# EAGLE design monBoard_1_backup (EAGLE 5.12)

## Sheet 1 of 3
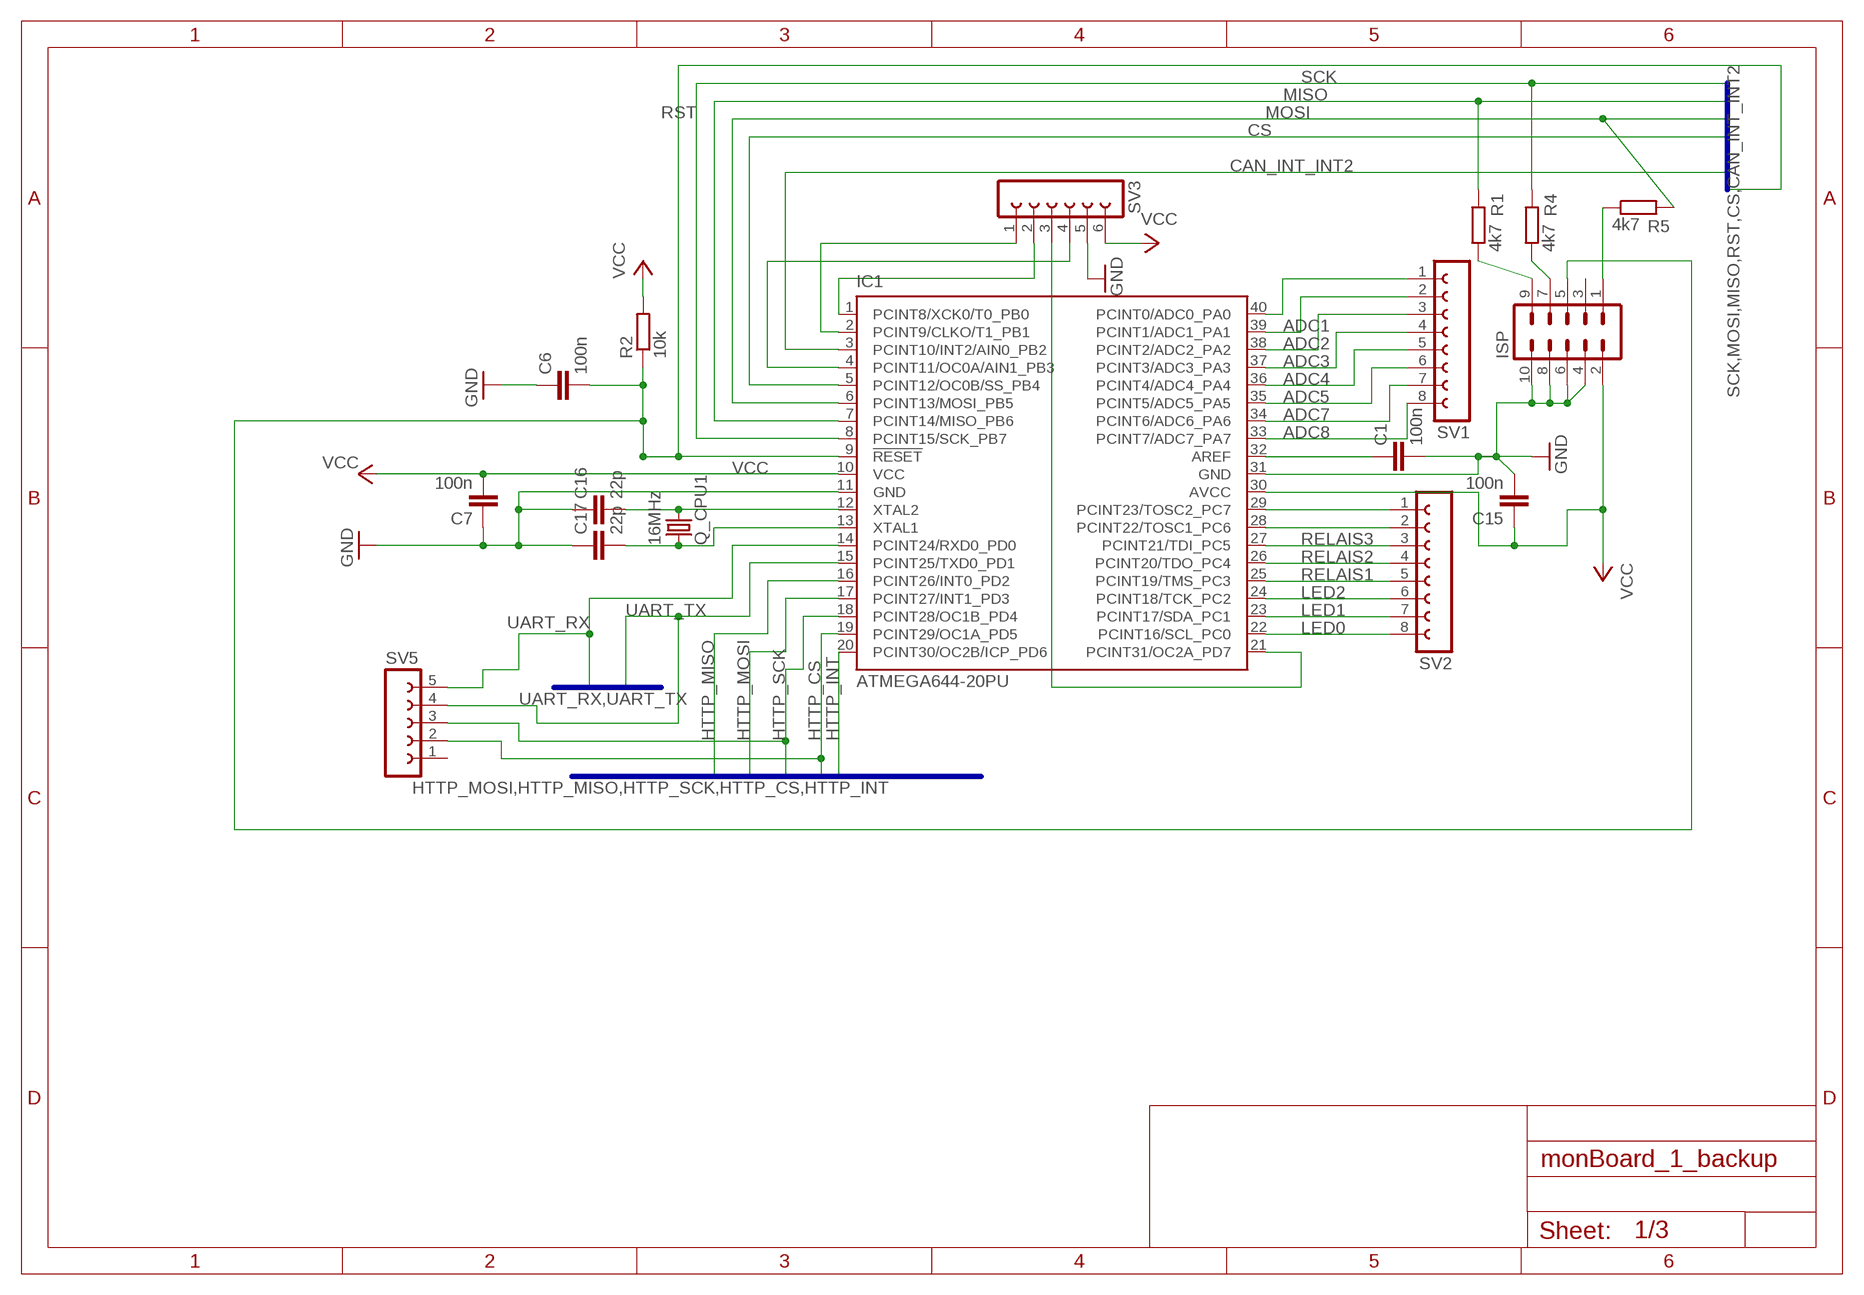
[diagram p0: schematic, sheet 1]

### Parts
C1  100n  C-EUC0603  [C0603]
C6  100n  C-EUC0603  [C0603]
C7  100n  C-EUC0603  [C0603]
C15  100n  C-EUC0603  [C0603]
C16  22p  C-EUC0603  [C0603]
C17  22p  C-EUC0603  [C0603]
IC1  ATMEGA644-20PU  [DIL40]
ISP  MA05-2  [MA05-2]
Q_CPU1  16MHz  CRYSTALHC49U-V  [HC49U-V]
R1  4k7  R-EU_R0805  [R0805]
R2  10k  R-EU_R0805  [R0805]
R4  4k7  R-EU_R0805  [R0805]
R5  4k7  R-EU_R0805  [R0805]
SV1  FE08-1  [FE08]
SV2  FE08-1  [FE08]
SV3  FE06-1  [FE06]
SV5  FE05-1  [FE05-1]

### Nets
ADC1: IC1.39(PCINT1/ADC1_PA1) SV1.2
ADC2: IC1.38(PCINT2/ADC2_PA2) SV1.3
ADC3: IC1.37(PCINT3/ADC3_PA3) SV1.4
ADC4: IC1.36(PCINT4/ADC4_PA4) SV1.5
ADC5: IC1.35(PCINT5/ADC5_PA5) SV1.6
ADC7: IC1.34(PCINT6/ADC6_PA6) SV1.7
ADC8: IC1.33(PCINT7/ADC7_PA7) SV1.8
CAN_INT_INT2: IC1.3(PCINT10/INT2/AIN0_PB2) ; also sheet 3
CS: IC1.5(PCINT12/OC0B/SS_PB4) ; also sheet 3
GND: C1.2 C6.1 C7.1 C15.2 C16.1 C17.1 IC1.11(GND) IC1.31(GND) ISP.4 ISP.6 ISP.8 ISP.10 SV3.5 ; also sheet 2,3
HTTP_CS: IC1.19(PCINT29/OC1A_PD5) SV5.2 ; also sheet 2
HTTP_INT: IC1.20(PCINT30/OC2B/ICP_PD6) ; also sheet 2
HTTP_MISO: IC1.16(PCINT26/INT0_PD2) ; also sheet 2
HTTP_MOSI: IC1.17(PCINT27/INT1_PD3) ; also sheet 2
HTTP_SCK: IC1.18(PCINT28/OC1B_PD4) SV5.3 ; also sheet 2
LED0: IC1.22(PCINT16/SCL_PC0) SV2.8
LED1: IC1.23(PCINT17/SDA_PC1) SV2.7
LED2: IC1.24(PCINT18/TCK_PC2) SV2.6
MISO: IC1.7(PCINT14/MISO_PB6) R1.2 ; also sheet 3
MOSI: IC1.6(PCINT13/MOSI_PB5) R5.2 ; also sheet 3
N$6: C16.2 IC1.12(XTAL2) Q_CPU1.1
N$7: C17.2 IC1.13(XTAL1) Q_CPU1.2
N$9: IC1.4(PCINT11/OC0A/AIN1_PB3) SV3.4
N$10: IC1.40(PCINT0/ADC0_PA0) SV1.1
N$14: IC1.29(PCINT23/TOSC2_PC7) SV2.1
N$19: C1.1 IC1.32(AREF)
N$20: ISP.9 R1.1
N$25: ISP.1 R5.1
N$29: ISP.7 R4.1
N$34: IC1.28(PCINT22/TOSC1_PC6) SV2.2
N$40: IC1.1(PCINT8/XCK0/T0_PB0) SV3.2
N$64: IC1.2(PCINT9/CLKO/T1_PB1) SV3.1
N$65: IC1.21(PCINT31/OC2A_PD7) SV3.3
RELAIS1: IC1.25(PCINT19/TMS_PC3) SV2.5
RELAIS2: IC1.26(PCINT20/TDO_PC4) SV2.4
RELAIS3: IC1.27(PCINT21/TDI_PC5) SV2.3
RST: C6.2 IC1.9(!RESET) ISP.5 R2.1 ; also sheet 3
SCK: IC1.8(PCINT15/SCK_PB7) R4.2 ; also sheet 3
UART_RX: IC1.14(PCINT24/RXD0_PD0) SV5.5 ; also sheet 3
UART_TX: IC1.15(PCINT25/TXD0_PD1) SV5.4 ; also sheet 3
VCC: C7.2 C15.1 IC1.10(VCC) IC1.30(AVCC) ISP.2 R2.2 SV3.6 ; also sheet 3
Unconnected: ISP.3 SV5.1

### Buses
SCK,MOSI,MISO,RST,CS,CAN_INT_INT2
UART_RX,UART_TX
HTTP_MOSI,HTTP_MISO,HTTP_SCK,HTTP_CS,HTTP_INT

## Sheet 2 of 3
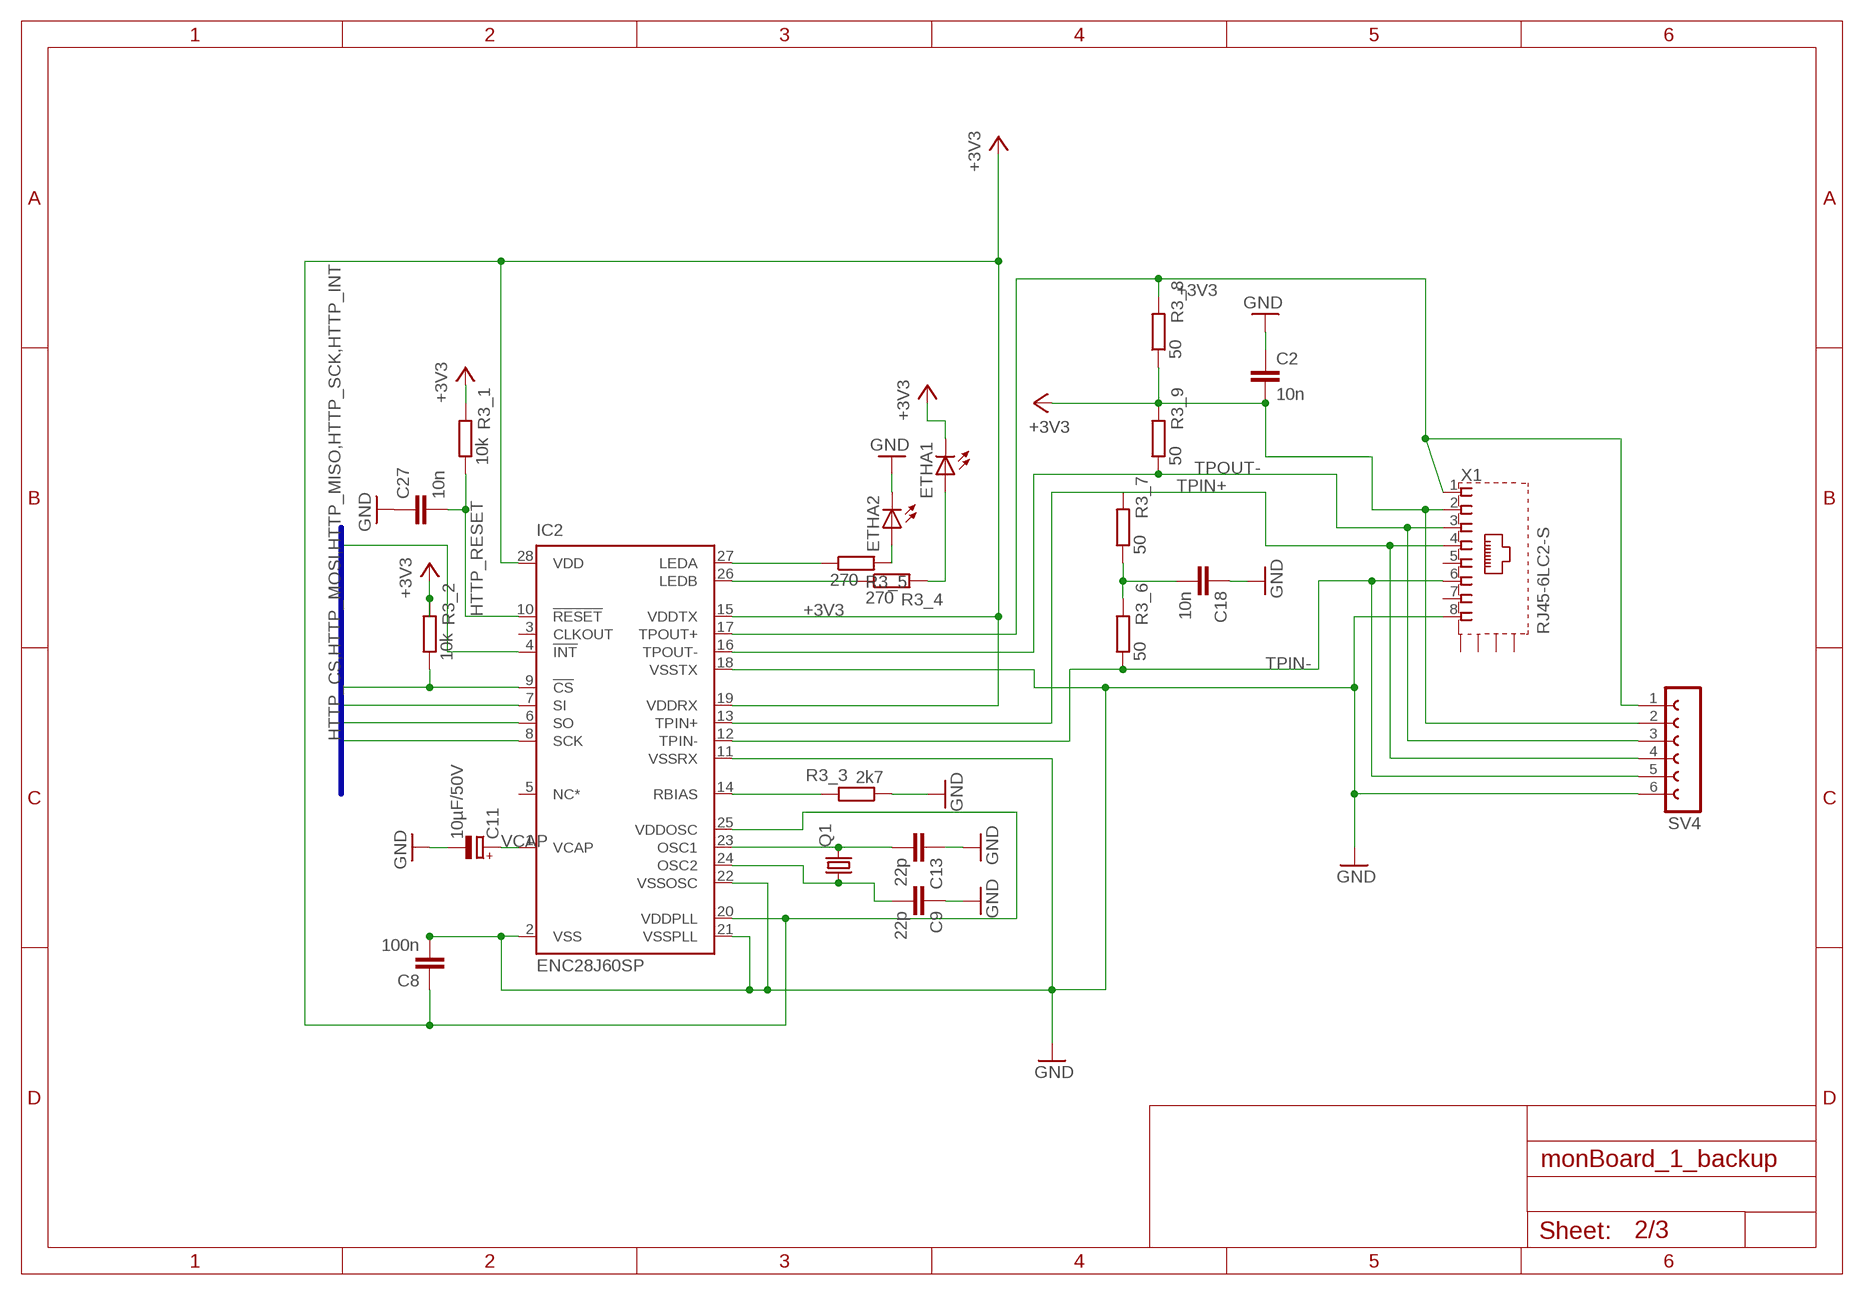
[diagram p1: schematic, sheet 2]

### Parts
C2  10n  C-EUC0603  [C0603]
C8  100n  C-EUC0603  [C0603]
C9  22p  C-EUC0603  [C0603]
C11  10µF/50V  CPOL-EUE3.5-8  [E3,5-8]
C13  22p  C-EUC0603  [C0603]
C18  10n  C-EUC0603  [C0603]
C27  10n  C-EUC0603  [C0603]
ETHA1  LEDCHIP-LED0805  [CHIP-LED0805]
ETHA2  LEDCHIP-LED0805  [CHIP-LED0805]
IC2  ENC28J60SP  [DIL28-3]
Q1  CRYSTALHC49U-V  [HC49U-V]
R3_1  10k  R-EU_R0805  [R0805]
R3_2  10k  R-EU_R0805  [R0805]
R3_3  2k7  R-EU_R0805  [R0805]
R3_4  270  R-EU_R0805  [R0805]
R3_5  270  R-EU_R0805  [R0805]
R3_6  50  R-EU_R0805  [R0805]
R3_7  50  R-EU_R0805  [R0805]
R3_8  50  R-EU_R0805  [R0805]
R3_9  50  R-EU_R0805  [R0805]
SV4  FE06W  [FE06W]
X1  RJ45-6LC2-S  [RJ45-SHIELD2]

### Nets
+3V3: C2.2 C8.1 ETHA1.C IC2.15(VDDTX) IC2.17(TPOUT+) IC2.19(VDDRX) IC2.20(VDDPLL) IC2.25(VDDOSC) IC2.28(VDD) R3_1.2 R3_2.2 R3_8.1 R3_8.2 R3_9.2 SV4.1 SV4.2 X1.1 X1.2 ; also sheet 3
GND: C2.1 C8.2 C9.1 C11.- C13.1 C18.1 C27.1 ETHA2.C IC2.2(VSS) IC2.11(VSSRX) IC2.18(VSSTX) IC2.21(VSSPLL) IC2.22(VSSOSC) R3_3.1 SV4.6 X1.8 ; also sheet 1,3
HTTP_CS: IC2.9(!CS) R3_2.1 ; also sheet 1
HTTP_INT: IC2.4(!INT) ; also sheet 1
HTTP_MISO: IC2.6(SO) ; also sheet 1
HTTP_MOSI: IC2.7(SI) ; also sheet 1
HTTP_RESET: C27.2 IC2.10(!RESET) R3_1.1
HTTP_SCK: IC2.8(SCK) ; also sheet 1
LEDA: ETHA2.A IC2.27(LEDA) R3_5.1 R3_5.2
N$13: IC2.26(LEDB) R3_4.1
N$16: ETHA1.A R3_4.2
N$24: C18.2 R3_6.2 R3_7.1
N$31: C9.2 IC2.24(OSC2) Q1.1
N$33: C13.2 IC2.23(OSC1) Q1.2
RBIAS: IC2.14(RBIAS) R3_3.2
TPIN+: IC2.13(TPIN+) R3_7.2 SV4.4 X1.4
TPIN-: IC2.12(TPIN-) R3_6.1 SV4.5 X1.6
TPOUT-: IC2.16(TPOUT-) R3_9.1 SV4.3 X1.3
VCAP: C11.+ IC2.1(VCAP)
Unconnected: IC2.3(CLKOUT) IC2.5(NC*) X1.5 X1.7 X1.S1(S) X1.S2(S) X1.S3(S) X1.S4(S)

### Buses
HTTP_CS,HTTP_MOSI,HTTP_MISO,HTTP_SCK,HTTP_INT

## Sheet 3 of 3
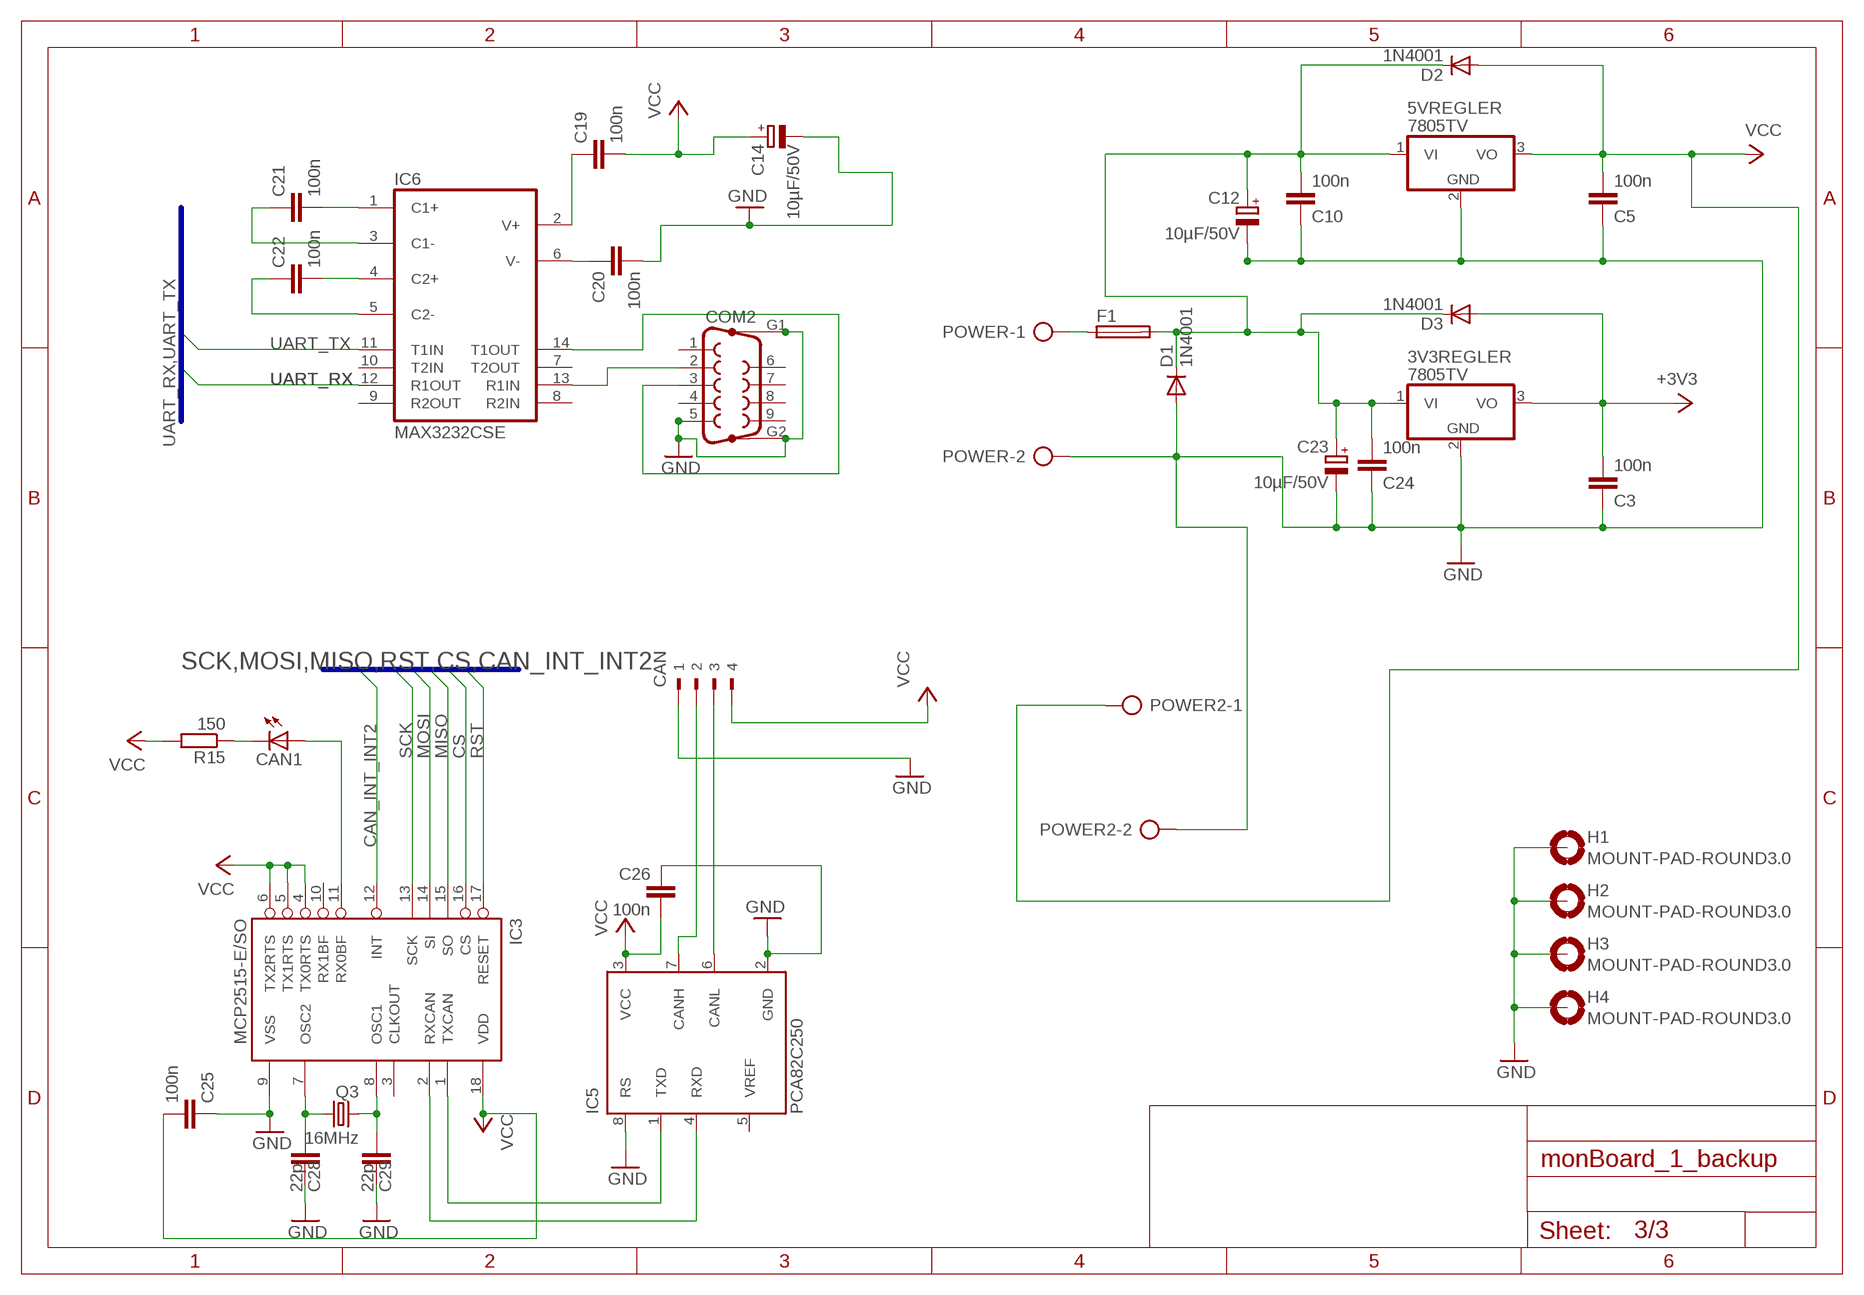
[diagram p2: schematic, sheet 3]

### Parts
3V3REGLER  7805TV  [TO220V]
5VREGLER  7805TV  [TO220V]
C3  100n  C-EUC0603  [C0603]
C5  100n  C-EUC0603  [C0603]
C10  100n  C-EUC0603  [C0603]
C12  10µF/50V  CPOL-EUE3.5-8  [E3,5-8]
C14  10µF/50V  CPOL-EUE3.5-8  [E3,5-8]
C19  100n  C-EUC0603  [C0603]
C20  100n  C-EUC0603  [C0603]
C21  100n  C-EUC0603  [C0603]
C22  100n  C-EUC0603  [C0603]
C23  10µF/50V  CPOL-EUE3.5-8  [E3,5-8]
C24  100n  C-EUC0603  [C0603]
C25  100n  C-EUC0603  [C0603]
C26  100n  C-EUC0603  [C0603]
C28  22p  C-EUC0603  [C0603]
C29  22p  C-EUC0603  [C0603]
CAN  90-4  [90-4]
CAN1  LEDCHIP-LED0805  [CHIP-LED0805]
COM2  F09HP  [F09HP]
D1  1N4001  1N4004  [DO41-10]
D2  1N4001  1N4004  [DO41-10]
D3  1N4001  1N4004  [DO41-10]
F1  SH22,5A  [SH22,5A]
H1  MOUNT-PAD-ROUND3.0  [3,0-PAD]
H2  MOUNT-PAD-ROUND3.0  [3,0-PAD]
H3  MOUNT-PAD-ROUND3.0  [3,0-PAD]
H4  MOUNT-PAD-ROUND3.0  [3,0-PAD]
IC3  MCP2515-E/SO  [SO18L]
IC5  PCA82C250  [DIL08]
IC6  MAX3232CSE  [SO16]
POWER  AK500/2-H  [AK500/2-H]
POWER2  AK500/2-H  [AK500/2-H]
Q3  16MHz  CRYSTALHC49U-V  [HC49U-V]
R15  150  R-EU_R0805  [R0805]

### Nets
+3V3: 3V3REGLER.3(VO) C3.2 D3.A ; also sheet 2
CAN_INT_INT2: IC3.12(INT) ; also sheet 1
CS: IC3.16(CS) ; also sheet 1
GND: 3V3REGLER.2(GND) 5VREGLER.2(GND) C3.1 C5.1 C10.1 C12.- C14.- C20.2 C23.- C24.1 C25.1 C26.1 C28.2 C29.2 CAN.1 COM2.5 COM2.G1 COM2.G2 D1.A H1.B3,0(MOUNT) H2.B3,0(MOUNT) H3.B3,0(MOUNT) H4.B3,0(MOUNT) IC3.9(VSS) IC5.2(GND) IC5.8(RS) POWER2.2 POWER.2 ; also sheet 1,2
MISO: IC3.15(SO) ; also sheet 1
MOSI: IC3.14(SI) ; also sheet 1
N$1: C21.2 IC6.1(C1+)
N$3: IC3.1(TXCAN) IC5.1(TXD)
N$4: IC3.2(RXCAN) IC5.4(RXD)
N$5: CAN1.A IC3.11(RX0BF)
N$11: CAN.3 IC5.6(CANL)
N$27: COM2.3 IC6.14(T1OUT)
N$28: COM2.2 IC6.13(R1IN)
N$30: C22.2 IC6.4(C2+)
N$36: C22.1 IC6.5(C2-)
N$37: C21.1 IC6.3(C1-)
N$43: C19.1 IC6.2(V+)
N$46: C20.1 IC6.6(V-)
N$48: CAN1.C R15.1
N$49 [Power]: F1.1 POWER.1
N$53: C28.1 IC3.7(OSC2) Q3.1
N$54: C29.1 IC3.8(OSC1) Q3.2
N$56 [Power]: 3V3REGLER.1(VI) 5VREGLER.1(VI) C10.2 C12.+ C23.+ C24.2 D1.C D2.C D3.C F1.2
N$59: CAN.2 IC5.7(CANH)
RST: IC3.17(RESET) ; also sheet 1
SCK: IC3.13(SCK) ; also sheet 1
UART_RX: IC6.12(R1OUT) ; also sheet 1
UART_TX: IC6.11(T1IN) ; also sheet 1
VCC: 5VREGLER.3(VO) C5.2 C14.+ C19.2 C25.2 C26.2 CAN.4 D2.A IC3.4(TX0RTS) IC3.5(TX1RTS) IC3.6(TX2RTS) IC3.18(VDD) IC5.3(VCC) POWER2.1 R15.2 ; also sheet 1
Unconnected: COM2.1 COM2.4 COM2.6 COM2.7 COM2.8 COM2.9 IC3.3(CLKOUT) IC3.10(RX1BF) IC5.5(VREF) IC6.7(T2OUT) IC6.8(R2IN) IC6.9(R2OUT) IC6.10(T2IN)

### Buses
UART_RX,UART_TX
SCK,MOSI,MISO,RST,CS,CAN_INT_INT2

## Power pins joined to a net without a drawn wire
GND: IC6.15(GND)
VCC: IC6.16(VCC)

## Library data of the parts
3V3REGLER 5VREGLER = linear:78*: Positive VOLTAGE REGULATOR Source: http://cache.national.com/ds/LM/LM78L05.pdf http://www.fairchildsemi.com/ds/LM/LM7805.pdf
C1-C3 C5-C10 C13 C15-C22 C24-C29 = rcl:C-EU: CAPACITOR, European symbol
C11 C12 C14 C23 = rcl:CPOL-EU: POLARIZED CAPACITOR, European symbol
CAN = con-weidmueller-sl35:90-4: WEIDMUELLER CLAMP CONNECTOR; OC_FARNELL: unknown; OC_NEWARK: unknown
CAN1 ETHA1 ETHA2 = led:LED: LED OSRAM: - CHIPLED LG R971, LG N971, LY N971, LG Q971, LY Q971, LO R971, LY R971 LH N974, LH R974 LS Q976, LO Q976, LY Q976 LO Q996 - Hyper CHIPLED LW Q18S LB Q993, LB Q99A, LB R99A - SideLED LS A670, LO A670, LY A670, LG A670, LP A670 LB A673, LV A673, LT A673, LW A673 LH A674 LY A675 LS A676, LA A676, LO A676, LY A676, LW A676 LS A679, LY A679, LG A679 - Hyper Micro SIDELED® LS Y876, LA Y876, LO Y876, LY Y876 LT Y87S - SmartLED LW L88C, LW L88S LB L89C, LB L89S, LG L890 LS L89K, LO L89K, LY L89K LS L896, LA L896, LO L896, LY L896 - TOPLED LS T670, LO T670, LY T670, LG T670, LP T670 LSG T670, LSP T670, LSY T670, LOP T670, LYG T670 LG T671, LOG T671, LSG T671 LB T673, LV T673, LT T673, LW T673 LH T674 LS T676, LA T676, LO T676, LY T676, LB T676, LH T676, LSB T676, LW T676 LB T67C, LV T67C, LT T67C, LS T67K, LO T67K, LY T67K, LW E67C LS E67B, LA E67B, LO E67B, LY E67B, LB E67C, LV E67C, LT E67C LW T67C LS T679, LY T679, LG T679 LS T770, LO T770, LY T770, LG T770, LP T770 LB T773, LV T773, LT T773, LW T773 LH T774 LS E675, LA E675, LY E675, LS T675 LS T776, LA T776, LO T776, LY T776, LB T776 LHGB T686 LT T68C, LB T68C - Hyper Mini TOPLED® LB M676 - Mini TOPLED Santana® LG M470 LS M47K, LO M47K, LY M47K Source: http://www.osram.convergy.de LUXEON: - LUMILED® LXK2-PW12-R00, LXK2-PW12-S00, LXK2-PW14-U00, LXK2-PW14-V00 LXK2-PM12-R00, LXK2-PM12-S00, LXK2-PM14-U00 LXK2-PE12-Q00, LXK2-PE12-R00, LXK2-PE12-S00, LXK2-PE14-T00, LXK2-PE14-U00 LXK2-PB12-K00, LXK2-PB12-L00, LXK2-PB12-M00, LXK2-PB14-N00, LXK2-PB14-P00, LXK2-PB14-Q00 LXK2-PR12-L00, LXK2-PR12-M00, LXK2-PR14-Q00, LXK2-PR14-R00 LXK2-PD12-Q00, LXK2-PD12-R00, LXK2-PD12-S00 LXK2-PH12-R00, LXK2-PH12-S00 LXK2-PL12-P00, LXK2-PL12-Q00, LXK2-PL12-R00 Source: www.luxeon.com KINGBRIGHT: KA-3528ASYC Source: www.kingbright.com
COM2 = con-subd:F09HP: SUB-D; OC_FARNELL: unknown; OC_NEWARK: unknown
D1-D3 = diode:1N4004: DIODE general purpose rectifier, 1 A
F1 = fuse:SH22,5A: FUSE HOLDER grid 22,5mm, isolated cap OGN0031 8201, Schurter (Buerklin)
H1-H4 = holes:MOUNT-PAD-ROUND: MOUNTING PAD, round
IC1 = atmel:ATMEGA644-*PU: 8-bit Microcontroller with 64K Bytes In-System Programmable Flash Auto generated by make-symbol-device-package-bsdl.ulp Rev. 34 Source: http://www.atmel.com/dyn/resources/prod_documents/doc2593.pdf; MPN: ATMEGA644-20PU; OC_FARNELL: 1288340; OC_NEWARK: 23M5060
IC2 = microchip:ENC28J60: Stand-Alone Ethernet Controller with SPI Interface Source: http://ww1.microchip.com/downloads/en/DeviceDoc/39662c.pdf; MF: MICROCHIP; MPN: ENC28J60/SP; OC_FARNELL: 1084619; OC_NEWARK: 96K3661
IC3 = mcp2515:MCP2515
IC5 = micro-philips:PCA82C250: CAN CONTROLLER INTERFACE; OC_FARNELL: 3692358; OC_NEWARK: unknown
IC6 = maxim:MAX3232*: True RS-232 Transceivers 3.0V to 5.5V, Low-Power up to 1Mbps, Using Four 0.1µF External Capacitors Source: http://pdfserv.maxim-ic.com/en/ds/MAX3222-MAX3241.pdf; MPN: MAX3232CSE; OC_FARNELL: 9725490; OC_NEWARK: 90C2890
ISP = con-lstb:MA05-2: PIN HEADER; OC_FARNELL: unknown; OC_NEWARK: unknown
POWER POWER2 = con-ptr500:AK500/2-H: CONNECTOR Aug. 2004 / PTR Meßtechnik: Die Bezeichnung der Serie AK505 wurde geändert. Es handelt sich hierbei um AK500 in horizontaler Ausführung.
Q1 Q3 Q_CPU1 = crystal:CRYSTAL: CRYSTAL; OC_FARNELL: 1666969; OC_NEWARK: unknown
R1 R2 R3_1-R3_9 R4 R5 R15 = rcl:R-EU_: RESISTOR, European symbol
SV1 SV2 = con-lsta:FE08-1: FEMALE HEADER; OC_FARNELL: unknown; OC_NEWARK: unknown
SV3 = con-lsta:FE06-1: FEMALE HEADER; OC_FARNELL: unknown; OC_NEWARK: unknown
SV4 = con-lsta:FE06W: FEMALE HEADER; OC_FARNELL: unknown; OC_NEWARK: unknown
SV5 = con-lsta:FE05-1: FEMALE HEADER; OC_FARNELL: unknown; OC_NEWARK: unknown
X1 = con-tycoelectronics:RJ45*2: RJ45 Low Profile Shield Type 2 For all RJ45 L, LC, LCT and X Series Models Source: www.tycoelectronics.com .. ENG_DS_1654001_1099_RJ_L_0507.pdf; MPN: RJ45-6LC2-S; OC_FARNELL: unknown; OC_NEWARK: 16R6095

## Net classes
1 Power: width 0.406 mm

## Board
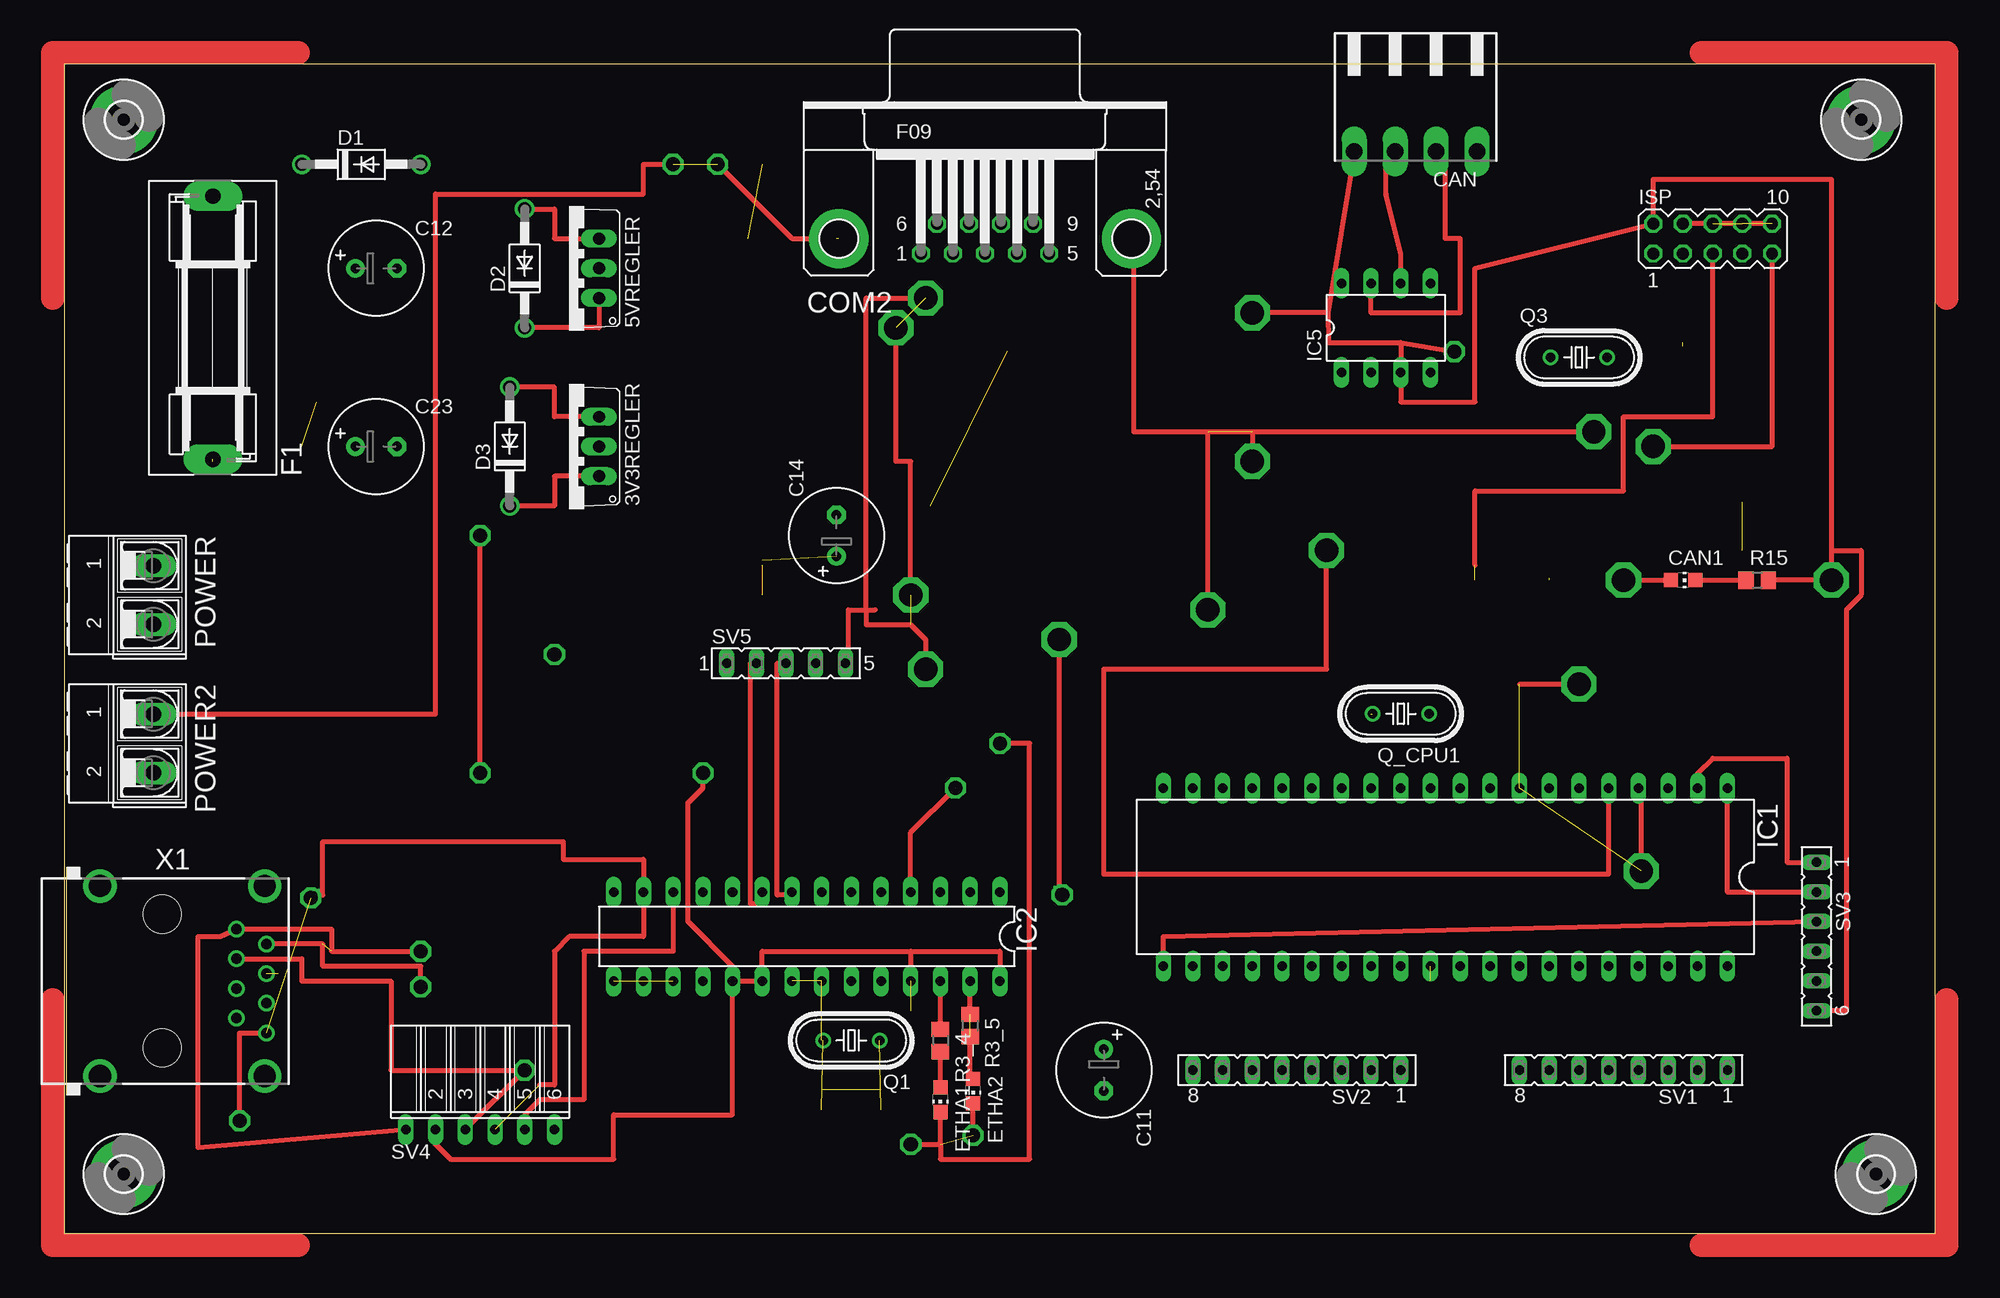
[diagram p3: board, top side]
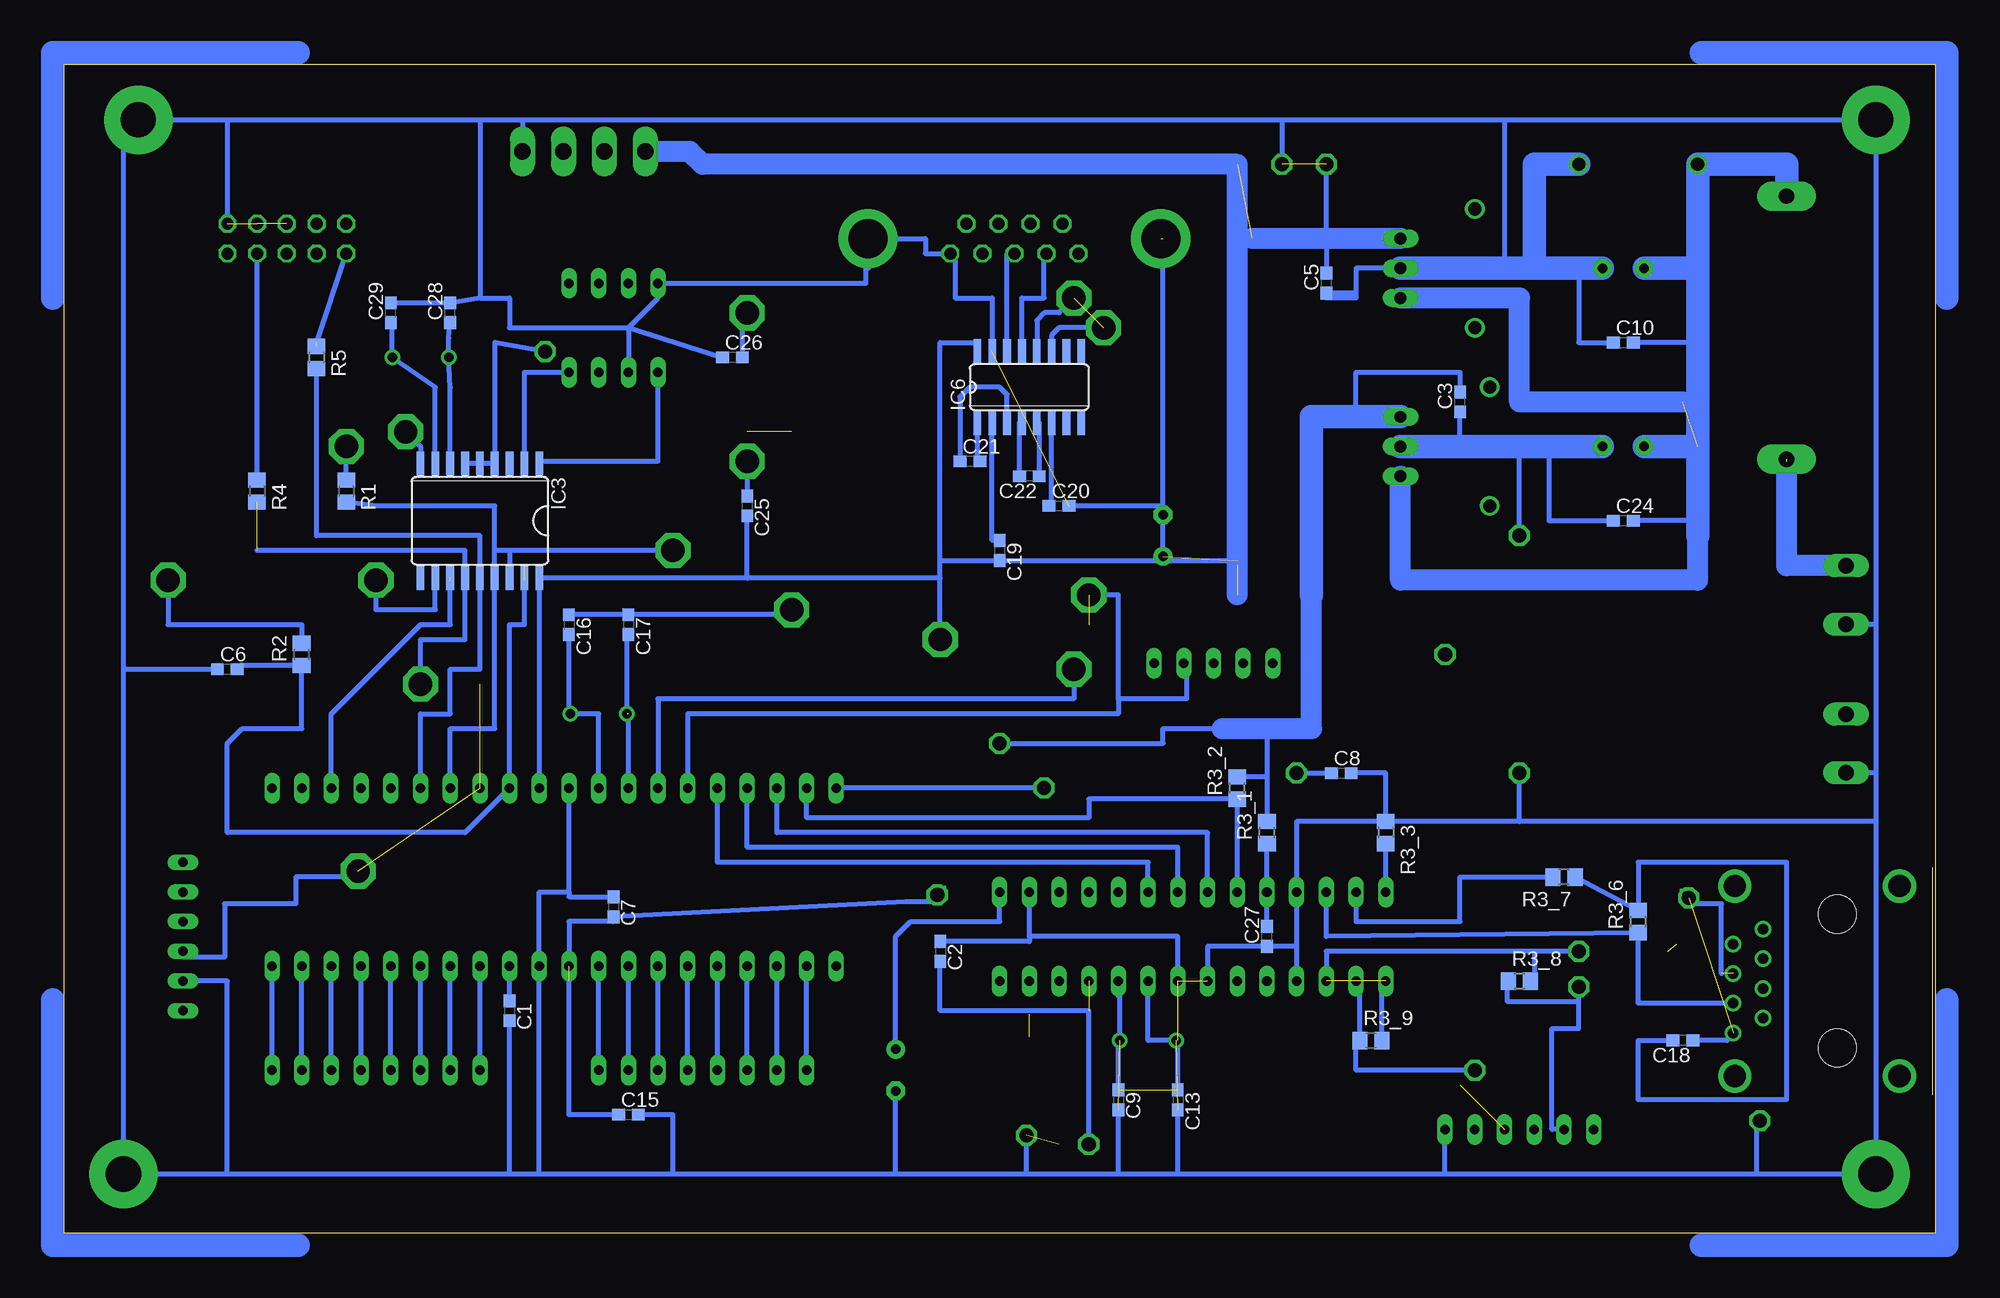
[diagram p4: board, bottom side, seen from below]

Size 160 x 100 mm. Coordinates in mm from the lower left corner, seen from the top.
Outline: 0,0 160,0 160,100 0,100 0,0
Copper layers (1*16): Top 0.035mm / dielectric 1.5mm / Bottom 0.035mm
Design rules "default": minimum track width 10mil, minimum drill 24mil, track to track 8mil, track to pad 8mil, pad to pad 8mil, via to via 8mil, smd to smd 8mil, copper to edge 40mil, drill to drill 8mil, minimum pad ring 10mil, minimum via ring 8mil, stop-mask expansion 4mil, vias tented up to drill 0mil, thermal gap 10mil

### Footprints (pad centres in the part's own frame; a part is rotated, then mirrored left to right if it is on the bottom)
TO220V = drill 1.016 long: 1 -2.54,-2.54; 2 0,-2.54; 3 2.54,-2.54
C0603 = smd 1.1 x 1: 1 -0.85,0; 2 0.85,0
E3,5-8 = drill 0.813 pad 1.6 round: + -1.778,0 | drill 0.813 pad 1.6 octagon: - 1.778,0
90-4 = drill 1.422 long: 1 -5.25,5.25; 2 -1.75,5.25; 3 1.75,5.25; 4 5.25,5.25
CHIP-LED0805 = smd 1.2 x 1.2: A 0,-1.05; C 0,1.05
F09HP = drill 1.016 octagon: 1 -5.486,-1.27; 2 -2.743,-1.27; 3 0,-1.27; 4 2.743,-1.27; 5 5.486,-1.27; 6 -4.115,1.27; 7 -1.372,1.27; 8 1.372,1.27; 9 4.115,1.27 | drill 3.302 pad 5.08 round: G1 -12.522,0; G2 12.522,0
DO41-10 = drill 1.118 round: A 5.08,0; C -5.08,0
SH22,5A = drill 1.321 pad 2.54 long: 1 -11.252,0; 2 11.252,0
3,0-PAD = drill 3 pad 5.842 round: B3,0 0,0
DIL40 = drill 0.813 long: 1 -24.13,-7.62; 2 -21.59,-7.62; 3 -19.05,-7.62; 4 -16.51,-7.62; 5 -13.97,-7.62; 6 -11.43,-7.62; 7 -8.89,-7.62; 8 -6.35,-7.62; 9 -3.81,-7.62; 10 -1.27,-7.62; 11 1.27,-7.62; 12 3.81,-7.62; 13 6.35,-7.62; 14 8.89,-7.62; 15 11.43,-7.62; 16 13.97,-7.62; 17 16.51,-7.62; 18 19.05,-7.62; 19 21.59,-7.62; 20 24.13,-7.62; 21 24.13,7.62; 22 21.59,7.62; 23 19.05,7.62; 24 16.51,7.62; 25 13.97,7.62; 26 11.43,7.62; 27 8.89,7.62; 28 6.35,7.62; 29 3.81,7.62; 30 1.27,7.62; 31 -1.27,7.62; 32 -3.81,7.62; 33 -6.35,7.62; 34 -8.89,7.62; 35 -11.43,7.62; 36 -13.97,7.62; 37 -16.51,7.62; 38 -19.05,7.62; 39 -21.59,7.62; 40 -24.13,7.62
DIL28-3 = drill 0.813 long: 1 -16.51,-3.81; 2 -13.97,-3.81; 3 -11.43,-3.81; 4 -8.89,-3.81; 5 -6.35,-3.81; 6 -3.81,-3.81; 7 -1.27,-3.81; 8 1.27,-3.81; 9 3.81,-3.81; 10 6.35,-3.81; 11 8.89,-3.81; 12 11.43,-3.81; 13 13.97,-3.81; 14 16.51,-3.81; 15 16.51,3.81; 16 13.97,3.81; 17 11.43,3.81; 18 8.89,3.81; 19 6.35,3.81; 20 3.81,3.81; 21 1.27,3.81; 22 -1.27,3.81; 23 -3.81,3.81; 24 -6.35,3.81; 25 -8.89,3.81; 26 -11.43,3.81; 27 -13.97,3.81; 28 -16.51,3.81
SO18L = smd 0.66 x 2.032: 1 -5.08,-4.902; 2 -3.81,-4.902; 3 -2.54,-4.902; 4 -1.27,-4.902; 5 0,-4.902; 6 1.27,-4.902; 7 2.54,-4.902; 8 3.81,-4.902; 9 5.08,-4.902; 10 5.08,4.902; 11 3.81,4.902; 12 2.54,4.902; 13 1.27,4.902; 14 0,4.902; 15 -1.27,4.902; 16 -2.54,4.902; 17 -3.81,4.902; 18 -5.08,4.902
DIL08 = drill 0.813 long: 1 -3.81,-3.81; 2 -1.27,-3.81; 3 1.27,-3.81; 4 3.81,-3.81; 5 3.81,3.81; 6 1.27,3.81; 7 -1.27,3.81; 8 -3.81,3.81
SO16 = smd 0.66 x 2.032: 1 -4.445,-3.073; 2 -3.175,-3.073; 3 -1.905,-3.073; 4 -0.635,-3.073; 5 0.635,-3.073; 6 1.905,-3.073; 7 3.175,-3.073; 8 4.445,-3.073; 9 4.445,3.073; 10 3.175,3.073; 11 1.905,3.073; 12 0.635,3.073; 13 -0.635,3.073; 14 -1.905,3.073; 15 -3.175,3.073; 16 -4.445,3.073
MA05-2 = drill 1.016 octagon: 1 -5.08,-1.27; 2 -5.08,1.27; 3 -2.54,-1.27; 4 -2.54,1.27; 5 0,-1.27; 6 0,1.27; 7 2.54,-1.27; 8 2.54,1.27; 9 5.08,-1.27; 10 5.08,1.27
AK500/2-H = drill 1.321 long: 1 -2.515,0; 2 2.515,0
HC49U-V = drill 0.813 round: 1 -2.413,0; 2 2.413,0
R0805 = smd 1.3 x 1.5: 1 -0.95,0; 2 0.95,0
FE08 = drill 0.813 long: 1 -8.89,0; 2 -6.35,0; 3 -3.81,0; 4 -1.27,0; 5 1.27,0; 6 3.81,0; 7 6.35,0; 8 8.89,0
FE06 = drill 0.813 long: 1 -6.35,0; 2 -3.81,0; 3 -1.27,0; 4 1.27,0; 5 3.81,0; 6 6.35,0
FE06W = drill 0.813 long: 1 -6.35,0; 2 -3.81,0; 3 -1.27,0; 4 1.27,0; 5 3.81,0; 6 6.35,0
FE05-1 = drill 0.813 long: 1 -5.08,0; 2 -2.54,0; 3 0,0; 4 2.54,0; 5 5.08,0
RJ45-SHIELD2 = drill 0.9 pad 1.4 round: 1 -4.445,6.35; 2 -3.175,8.89; 3 -1.905,6.35; 4 -0.635,8.89; 5 0.635,6.35; 6 1.905,8.89; 7 3.175,6.35; 8 4.445,8.89 | drill 1.9 pad 2.5 round: S1 -8.128,-5.33; S2 8.128,-5.33; S3 -8.128,8.76; S4 8.128,8.76 | hole 3.251: -5.715,0; 5.715,0

### Placement (x,y rotation side)
3V3REGLER  43.18,67.31 90 top
5VREGLER  43.18,82.55 90 top
C1  121.92,19.05 270 bottom
C2  85.09,24.13 270 bottom
C3  40.64,71.12 90 bottom
C5  52.07,81.28 90 bottom
C6  146.05,48.26 0 bottom
C7  113.03,27.94 270 bottom
C8  50.8,39.37 0 bottom
C9  69.85,11.43 270 bottom
C10  26.67,76.2 0 bottom
C11  88.9,13.97 270 top
C12  26.67,82.55 0 top
C13  64.77,11.43 270 bottom
C14  66.04,59.69 90 top
C15  111.76,10.16 0 bottom
C16  116.84,52.07 270 bottom
C17  111.76,52.07 270 bottom
C18  21.59,16.51 180 bottom
C19  80.01,58.42 270 bottom
C20  74.93,62.23 0 bottom
C21  82.55,66.04 0 bottom
C22  77.47,64.77 180 bottom
C23  26.67,67.31 0 top
C24  26.67,60.96 0 bottom
C25  101.6,62.23 270 bottom
C26  102.87,74.93 0 bottom
C27  57.15,25.4 90 bottom
C28  127,78.74 90 bottom
C29  132.08,78.74 90 bottom
CAN  115.57,97.79 180 top
CAN1  138.43,55.88 270 top
COM2  78.74,85.09 0 top
D1  25.4,91.44 0 top
D2  39.37,82.55 90 top
D3  38.1,67.31 90 top
ETHA1  74.93,11.43 180 top
ETHA2  77.72,12.19 180 top
F1  12.7,77.47 90 top
H1  154.94,5.08 0 top
H2  5.08,95.25 0 top
H3  5.08,5.08 0 top
H4  153.67,95.25 0 top
IC1  118.11,30.48 180 top
IC2  63.5,25.4 180 top
IC3  124.46,60.96 180 bottom
IC5  113.03,77.47 0 top
IC6  77.47,72.39 0 bottom
ISP  140.97,85.09 0 top
POWER  7.62,54.61 270 top
POWER2  7.62,41.91 270 top
Q1  67.31,16.51 180 top
Q3  129.54,74.93 0 top
Q_CPU1  114.3,44.45 180 top
R1  135.89,63.5 270 bottom
R2  139.7,49.53 90 bottom
R3_1  57.15,34.29 90 bottom
R3_2  59.69,38.1 90 bottom
R3_3  46.99,34.29 270 bottom
R3_4  74.93,16.51 270 top
R3_5  77.47,17.78 270 top
R3_6  25.4,26.67 90 bottom
R3_7  31.75,30.48 180 bottom
R3_8  35.56,21.59 0 bottom
R3_9  48.26,16.51 0 bottom
R4  143.51,63.5 270 bottom
R5  138.43,74.93 270 bottom
R15  144.78,55.88 0 top
SV1  133.35,13.97 180 top
SV2  105.41,13.97 180 top
SV3  149.86,25.4 270 top
SV4  35.56,8.89 0 top
SV5  61.72,48.77 0 top
X1  8.38,21.59 270 top

### Tracks (layer width: path | path; a pad name or v marks a point on that pad's centre or on a via)
+3V3  (via drill 0.6, 1.2 pad 1.78)  (5 unrouted)
  Top 0.406: 3V3REGLER.3 41.91,69.85 41.91,72.39 D3.A | 74.93,7.62 74.93,6.35 82.55,6.35 82.55,41.91 v80.01,41.91 | v72.39,7.62 74.93,7.62 | SV4.2 31.75,7.62 33.02,6.35 46.99,6.35 46.99,10.16 57.15,10.16 IC2.19 | IC2.19 57.15,22.86 53.34,26.67 53.34,36.83 54.61,38.1 v54.61,39.37 | IC2.19 IC2.20 59.69,24.13 72.39,24.13 | 72.39,24.13 IC2.25 | 72.39,24.13 80.01,24.13 IC2.28 | X1.2 22.1,24.77 22.1,22.86 30.48,22.86 v30.48,21.08 | v30.48,24.13 22.86,24.13 22.86,26.04 X1.1 13.34,25.4 11.43,25.4 11.43,7.37 SV4.1 | 74.93,7.62 ETHA1.C
  Bottom 0.406: C3.2 40.64,73.66 49.53,73.66 49.53,69.85 | R3_9.2 47.31,21.59 | v80.01,41.91 66.04,41.91 66.04,43.18 60.96,43.18 | 57.15,39.05 R3_2.2 | 57.15,43.18 57.15,39.05 | 56.73,35.24 R3_1.2 57.15,39.05 | C2.2 85.09,19.05 72.39,19.05 v72.39,7.62 | v54.61,39.37 C8.1 | R3_8.1 36.58,21.59 36.58,19.81 30.48,19.81 | SV4.2 32.77,8.89 32.77,17.53 30.48,17.53 30.48,19.81 | R3_8.2 34.29,21.59 34.29,24.13 | 34.29,24.13 52.07,24.13 IC2.17 | v30.48,24.13 34.29,24.13 | 30.48,19.81 v30.48,21.08
  Bottom 1.778: 53.34,54.61 53.34,43.18 57.15,43.18 60.96,43.18
  Bottom 2: 3V3REGLER.3 49.53,69.85 53.34,69.85 53.34,54.61
  other vias: 77.72,8.38
+24V  (via drill 1.2 pad 1.78)
  other vias: 118.87,75.44
ADC1
  Bottom 0.406: SV1.2 IC1.39
ADC2
  Bottom 0.406: SV1.3 IC1.38
ADC3
  Bottom 0.406: SV1.4 IC1.37
ADC4
  Bottom 0.406: SV1.5 IC1.36
ADC5
  Bottom 0.406: SV1.6 IC1.35
ADC7
  Bottom 0.406: SV1.7 IC1.34
ADC8
  Bottom 0.406: SV1.8 IC1.33
CAN_INT_INT2  (1 unrouted)
  Bottom 0.406: IC1.3 137.16,44.45 129.54,52.07 127,52.07 127,55.88
CS  (via drill 2)
  Top 0.406: IC1.5 132.08,30.73 88.9,30.73 88.9,48.26 107.95,48.26 v107.95,58.42
  Bottom 0.406: 121.92,58.42 IC3.16 | v107.95,58.42 121.92,58.42 | 121.92,58.42 123.19,58.42
GND  (via drill 0.6, 1.2 pad 1.78, 2)  (10 unrouted)
  Top 0.406: 91.44,85.09 COM2.G2 91.44,84.91 91.44,68.58 101.6,68.58 | 101.6,68.58 v130.81,68.58 | 101.6,68.58 v101.6,66.04 | v35.56,39.37 v35.56,59.69 | 55.88,91.44 62.23,85.09 66.04,85.09 | ISP.10 ISP.4 | v97.79,53.34 97.79,68.58 | v77.72,8.38 ETHA2.C | X1.8 14.99,17.14 v14.99,9.65
  Bottom 0.406: H3.B3,0 15.24,5.08 | 15.24,5.08 41.91,5.08 | 41.91,5.08 77.72,5.08 | 77.72,5.08 88.9,5.08 | 88.9,5.08 107.95,5.08 | 107.95,5.08 119.38,5.08 | 119.38,5.08 121.92,5.08 | 121.92,5.08 146.05,5.08 | 146.05,5.08 H1.B3,0 154.94,48.26 | 154.94,48.26 154.94,95.25 | 36.83,95.25 H2.B3,0 5.08,52.07 | 55.88,95.25 36.83,95.25 | 124.46,95.25 120.65,95.25 | 120.65,95.25 55.88,95.25 | 146.05,95.25 124.46,95.25 | H4.B3,0 146.05,95.25 | 146.05,95.25 ISP.10 | 154.94,48.26 C6.1 | C20.2 66.04,62.23 C14.- | C29.2 C28.2 124.46,80.01 | 124.46,95.25 124.46,80.01 | 111.76,77.47 IC5.2 | 111.76,77.47 121.92,77.47 121.92,80.01 124.46,80.01 | C13.1 64.77,16.51 | C9.1 69.85,16.51 | C15.2 107.95,10.16 107.95,5.08 | 121.92,5.08 C1.2 | 119.38,5.08 IC1.31 119.38,29.21 116.84,29.21 | 116.84,29.21 IC1.11 | C7.1 116.84,28.79 116.84,29.21 | IC6.15 80.64,80.01 83.82,80.01 83.82,83.82 COM2.5 86.36,83.82 86.36,85.09 COM2.G2 91.26,82.55 91.44,82.55 91.44,81.28 IC5.8 109.22,80.01 111.76,77.47 | IC3.9 129.54,67.31 v130.81,68.58 | 111.76,77.47 C26.1 | C16.1 C17.1 98.21,52.92 v97.79,53.34 | 5VREGLER.2 49.53,82.55 49.53,80.43 | 49.53,80.43 49.53,80.01 52.07,80.01 C5.1 49.53,80.43 | 40.64,67.31 C3.1 | C24.1 33.02,60.96 33.02,67.31 | C10.1 30.48,76.2 30.48,82.55 | v101.6,66.04 C25.1 | R3_3.1 46.99,39.37 C8.2 | 5.08,35.24 35.56,35.24 | 35.56,35.24 R3_3.1 | 54.61,24.55 IC2.11 54.61,35.24 R3_3.1 | IC2.22 64.77,25.4 77.47,25.4 | 77.47,25.4 IC2.2 | C2.1 77.47,24.98 77.47,25.4 | 54.61,24.55 C27.1 62.23,24.55 IC2.21 | 54.61,24.55 IC2.18 | C18.1 17.78,16.51 X1.8 | 5.08,35.24 5.08,6.35 | 36.83,95.25 36.83,82.55 | 34.29,67.31 C23.- | v35.56,59.69 35.56,67.31 | 35.56,35.24 v35.56,39.37 | 146.05,5.08 146.05,21.59 SV3.5
  Bottom 0.406: 41.91,5.08 SV4.6 | POWER.2 5.11,52.09 5.08,52.07 | 5.08,52.07 5.08,39.37 | 5.08,39.37 5.08,35.24 | POWER2.2 5.11,39.4 5.08,39.37 | 88.9,5.08 C11.- | 55.88,95.25 55.88,91.44 | CAN.1 120.82,95.08 120.65,95.25 | 77.72,5.08 v77.72,8.38 | v14.99,9.65 15.24,9.65 15.24,5.08
  Bottom 2: 154.94,95.25 H4.B3,0 | D1.A 34.29,91.44 34.29,82.55 | 34.29,82.55 36.83,82.55 5VREGLER.2 | C12.- 30.48,82.55 34.29,82.55 | C23.- 33.02,67.31 34.29,67.31 35.56,67.31 40.64,67.31 3V3REGLER.2
  other vias: 21.08,28.7
HTTP_CS
  Top 0.406: SV5.2 58.67,48.77 58.67,28.19 59.69,28.19 IC2.9
  Bottom 0.406: IC2.9 R3_2.1 72.39,37.15 72.39,35.56 96.52,35.56 IC1.19
HTTP_INT  (1 unrouted)
  Top 0.406: IC2.4 72.39,34.29 76.2,38.1
  Bottom 0.406: 76.2,38.1 IC1.20
HTTP_MISO
  Bottom 0.406: IC1.16 104.14,31.75 76.2,31.75 67.31,31.75 IC2.6
HTTP_MOSI
  Bottom 0.406: IC1.17 101.6,33.02 76.2,33.02 74.93,33.02 64.77,33.02 IC2.7
HTTP_RESET
  Bottom 0.406: R3_1.1 IC2.10 C27.2
HTTP_SCK
  Top 0.406: SV5.3 60.96,48.77 60.96,28.96 62.23,28.96 IC2.8
  Bottom 0.406: IC2.8 62.23,34.29 99.06,34.29 IC1.18
LED0
  Bottom 0.406: SV2.8 IC1.22
LED1
  Bottom 0.406: SV2.7 IC1.23
LED2
  Bottom 0.406: SV2.6 IC1.24
LEDA  (1 unrouted)
  Top 0.406: R3_5.1 IC2.27 | R3_5.2 77.47,13.5 ETHA2.A
MISO
  Bottom 0.406: R1.2 133.35,62.23 123.19,62.23 IC3.15 123.19,43.18 127,43.18 IC1.7
MOSI
  Bottom 0.406: R5.2 138.43,59.69 124.46,59.69 IC3.14 124.46,48.26 127,48.26 127,44.45 129.54,44.45 IC1.6
N$1
  Bottom 0.406: IC6.1 81.92,66.25 C21.2
N$2
  Top 2: 20,-1 -1,-1 -1,20
N$3
  Bottom 0.406: IC5.1 109.22,66.04 119.38,66.04 IC3.1
N$4
  Bottom 0.406: IC5.4 120.65,73.66 IC3.2
N$5  (via drill 2)
  Top 0.406: v133.35,55.88 CAN1.A
  Bottom 0.406: IC3.11 128.27,53.34 133.35,53.34 v133.35,55.88
N$6
  Bottom 0.406: IC1.12 114.3,44.45 Q_CPU1.1 116.84,44.45 C16.2
N$7  (1 unrouted)
  Bottom 0.406: IC1.13 111.76,44.45 | C17.2 111.89,51.22 Q_CPU1.2
N$8
  Top 2: 140,-1 161,-1 161,20
N$9  (via drill 0.6)
  Top 0.406: IC1.4 134.87,38.1 v134.87,30.48
  Bottom 0.406: v134.87,30.48 140.21,30.48 140.21,28.19 146.3,28.19 146.3,23.62 149.86,23.62 SV3.4
N$10
  Bottom 0.406: SV1.1 IC1.40
N$11
  Top 0.406: IC5.6 114.3,83.82 113.03,88.9 113.03,92.54 CAN.3
N$12  (via drill 1.2 pad 1.78)
  other vias: 85.34,28.96 85.34,28.96
N$13
  Top 0.406: R3_4.1 IC2.26
N$14
  Bottom 0.406: SV2.1 IC1.29
N$16
  Top 0.406: ETHA1.A R3_4.2
N$17
  Top 2: 20,101 -1,101 -1,80
N$18
  Top 2: 161,80 161,101 140,101
N$19
  Bottom 0.406: C1.1 IC1.32
N$20  (via drill 2)
  Top 0.406: ISP.9 146.05,67.31 v135.89,67.31
  Bottom 0.406: R1.1 v135.89,67.31
N$21
  Bottom 2: 20,-1 -1,-1 -1,20
N$22
  Bottom 2: 140,-1 161,-1 161,20
N$23
  Bottom 2: 20,101 -1,101 -1,80
N$24
  Bottom 0.406: R3_7.1 R3_6.2 25.4,31.75 12.7,31.75 12.7,11.43 25.4,11.43 25.4,16.51 C18.2
N$25  (1 unrouted)
  Bottom 0.406: 138.43,76.2 ISP.1
N$26
  Bottom 2: 161,80 161,101 140,101
N$27
  Bottom 0.406: COM2.3 79.38,83.82 IC6.14
N$28
  Bottom 0.406: COM2.2 76.2,83.82 76.2,80.01 78.11,80.01 IC6.13
N$29
  Bottom 0.406: R4.1 ISP.7
N$30
  Bottom 0.406: IC6.4 78.32,69.32 C22.2
N$31  (1 unrouted)
  Bottom 0.406: IC2.24 69.85,20.32 69.72,20.32 Q1.1 69.85,16.51 | 69.85,5.08 C9.2
N$33  (1 unrouted)
  Bottom 0.406: Q1.2 67.31,16.51 IC2.23 | 64.77,5.08 C13.2
N$34
  Bottom 0.406: SV2.2 IC1.28
N$36
  Bottom 0.406: IC6.5 76.62,69.32 C22.1
N$37
  Bottom 0.406: C21.1 83.4,71.54 82.55,72.39 80.01,72.39 79.38,71.75 IC6.3
N$38  (via drill 1.2 pad 1.78)  (1 unrouted)
  other vias: 55.88,91.44 52.07,91.44
N$40
  Top 0.406: IC1.1 142.24,29.21 SV3.2
N$43
  Bottom 0.406: C19.1 80.64,59.27 IC6.2
N$46
  Bottom 0.406: C20.1 75.56,62.23 IC6.6
N$48
  Top 0.406: CAN1.C R15.1
N$49  (1 unrouted)
  Bottom 1.778: POWER.1 12.7,57.12 12.7,66.04
N$50  (via drill 2)
  other vias: 101.6,78.74
N$53
  Bottom 0.406: C28.1 127.13,76.62 Q3.1 127,72.39 IC3.7
N$54
  Bottom 0.406: C29.1 131.95,77.89 Q3.2 128.27,72.39 IC3.8
N$56  (1 unrouted)
  Top 0.406: D3.C 41.91,62.23 41.91,64.77 3V3REGLER.1 | D2.C 45.72,77.47 5VREGLER.1
  Bottom 0.406: 20.32,60.96 C24.2 | 20.32,76.2 C10.2
  Bottom 1.778: 21.59,71.12 35.56,71.12 35.56,80.01 5VREGLER.1 | 20.32,59.69 20.32,55.88 45.72,55.88 3V3REGLER.1
  Bottom 2: F1.2 12.7,91.44 D1.C 20.32,82.55 | 20.32,67.31 20.32,76.2 20.32,82.55 | 20.32,82.55 C12.+ | 20.32,67.31 C23.+ | 20.32,59.69 20.32,60.96 20.32,67.31
N$59
  Top 0.406: IC5.7 111.76,78.74 119.38,78.74 119.38,85.09 118.11,85.09 118.11,92.54 CAN.2
N$63  (via drill 2)
  other vias: 73.66,48.26
N$64
  Top 0.406: IC1.2 139.7,39.37 140.97,40.64 147.32,40.64 147.32,31.75 SV3.1
N$65
  Top 0.406: IC1.21 93.98,25.4 SV3.3
N$66  (via drill 1.2 pad 1.78)
  other vias: 80.01,41.91
N$67  (via drill 1.2 pad 1.78)
  other vias: 41.91,49.53
N$69  (via drill 1.2 pad 1.78)
  other vias: 76.2,38.1
RBIAS
  Bottom 0.406: IC2.14 R3_3.2
RELAIS1
  Bottom 0.406: SV2.5 IC1.25
RELAIS2
  Bottom 0.406: SV2.4 IC1.26
RELAIS3
  Bottom 0.406: SV2.3 IC1.27
RST  (2 unrouted)
  Top 0.406: ISP.5 140.97,69.85 133.35,69.85 133.35,63.5 120.65,63.5 120.65,57.15
  Bottom 0.406: 120.65,55.88 120.65,52.07 121.92,52.07 IC1.9 125.73,34.29 146.05,34.29 146.05,41.91 144.78,43.18 139.7,43.18 R2.1 144.88,48.58 C6.2
SCK  (via drill 2)  (3 unrouted)
  Top 0.406: 124.46,46.99 v129.54,46.99
  Bottom 0.406: 143.51,58.42 125.73,58.42 IC3.13 125.73,50.8 129.54,50.8 v129.54,46.99
  other vias: 134.87,30.99
TPIN+  (via drill 0.6)  (2 unrouted)
  Top 0.406: 40.64,12.7 41.91,12.7 41.91,24.13 43.18,25.4 49.53,25.4 IC2.13 49.53,32 42.67,32 42.67,33.53 22.1,33.53 22.1,28.96 v21.34,28.96
  Bottom 0.406: IC2.13 49.53,26.67 40.64,26.67 40.64,30.48 R3_7.2 33.02,30.48 | 18.29,22.23 18.29,28.19 21.34,28.19 v21.34,28.96
TPIN-
  Top 0.406: SV4.5 39.37,10.16 40.64,11.43 44.45,11.43 44.45,24.13 52.07,24.13 IC2.12
  Bottom 0.406: IC2.12 52.07,25.4 R3_6.1 25.4,19.68 X1.6
TPOUT-  (via drill 1.2 pad 1.78)
  Top 0.406: X1.3 20.32,23.5 20.32,21.59 27.94,21.59 27.94,13.97 v39.37,13.97 SV4.3
  Bottom 0.406: IC2.16 49.21,21.59 R3_9.1 49.53,16.51 49.53,13.97 v39.37,13.97
UART_RX  (via drill 0.6, 2)  (2 unrouted)
  Top 0.406: v73.66,48.26 73.66,50.8 72.39,52.07 68.58,52.07 68.58,53.34 | 68.58,53.34 68.58,80.01 v73.66,80.01 | SV5.5 67.06,48.77 67.06,53.34 68.58,53.34 | 68.58,53.34 69.34,53.34
  Bottom 0.406: IC1.14 109.22,45.72 73.66,45.72 v73.66,48.26 | v73.66,80.01 74.93,78.74 76.2,78.74 76.83,78.11 IC6.12
  other vias: 71.12,77.47 72.39,54.61
UART_TX  (via drill 0.6)
  Top 0.406: v72.39,54.61 72.39,66.04 71.12,66.04 v71.12,77.47
  Bottom 0.406: IC1.15 106.68,44.45 69.85,44.45 69.85,45.72 | 69.85,45.72 69.85,54.61 v72.39,54.61 | v71.12,77.47 74.93,77.47 75.56,76.83 IC6.11 | SV5.4 64.01,48.77 64.01,45.72 69.85,45.72
VCAP
  Bottom 0.406: C11.+ 88.9,25.4 87.63,26.67 80.01,26.67 IC2.1
VCC  (via drill 0.6, 2)  (5 unrouted)
  Top 0.406: 114.3,76.2 IC5.3 114.3,71.12 120.65,71.12 120.65,82.55 ISP.2 135.89,90.17 151.13,90.17 151.13,58.42 | 114.3,76.2 108.12,76.2 108.08,78.74 | CAN.4 108.08,78.74 | R15.2 v151.13,55.88 151.13,58.42 | v101.6,78.74 108.08,78.74 | 151.13,58.42 153.67,58.42 153.67,54.61 152.4,53.34 152.4,19.05 SV3.6 | POWER2.1 31.75,44.42 31.75,88.9 49.53,88.9 49.53,91.44 52.07,91.44 | D2.A 41.91,87.63 41.91,85.09 5VREGLER.3 | 114.3,76.2 v118.87,75.44 | v85.09,29.21 v85.09,50.8
  Bottom 0.406: 85.09,57.57 C19.2 59.69,57.57 59.69,57.15 | 85.09,57.57 85.09,76.2 81.92,76.2 IC6.16 | R2.2 139.7,52.07 151.13,52.07 v151.13,55.88 | C15.1 116.84,10.16 116.84,21.59 | 85.09,56.06 85.09,57.57 | IC1.30 116.84,26.67 113.03,26.67 C7.2 88.05,28.36 85.94,28.36 v85.09,29.21 | 85.09,56.06 101.6,56.06 | 101.6,56.06 IC3.18 IC1.10 | IC3.6 IC3.5 IC3.4 123.19,76.2 v118.87,75.44 | 101.6,56.06 C25.2 | C26.2 102.02,78.32 v101.6,78.74 | v85.09,50.8 85.09,56.06 | 52.07,91.44 52.07,85.09 C5.2 | C14.+ 66.04,85.09
  Bottom 1.778: 59.69,54.61 59.69,91.44 105.41,91.44 106.51,92.54 CAN.4 | 5VREGLER.3 52.07,85.09 58.42,85.09